# Altium schematic sheet [02] - CONNECTORS.SchDoc: CONNECTORS
size 433 x 279 mm; Author: ZAG; DrawnBy: ZAG; DocumentNumber: 2; SheetNumber: 2; SheetTotal: 8; PageSetup: Record=PageOptions|CenterHorizontal=True|CenterVertical=True|PrintScale=0.96|XCorrection=1.00|YCorrection=1.00|PrintKind=2|BorderSize=5000000|LeftOffset=0|BottomOffset=0|Orientation=2|PaperLength=4318|PaperWidth=2794|Scale=100|PaperSource=15|PrintQuality=600|MediaType=1|DitherType=10|PaperKind=11x17|PrintScaleMode=1; SchRevision: 01; PCBRevision: 01; Project: VAN BATT CTRLR V1; SchStatus: PRELIM
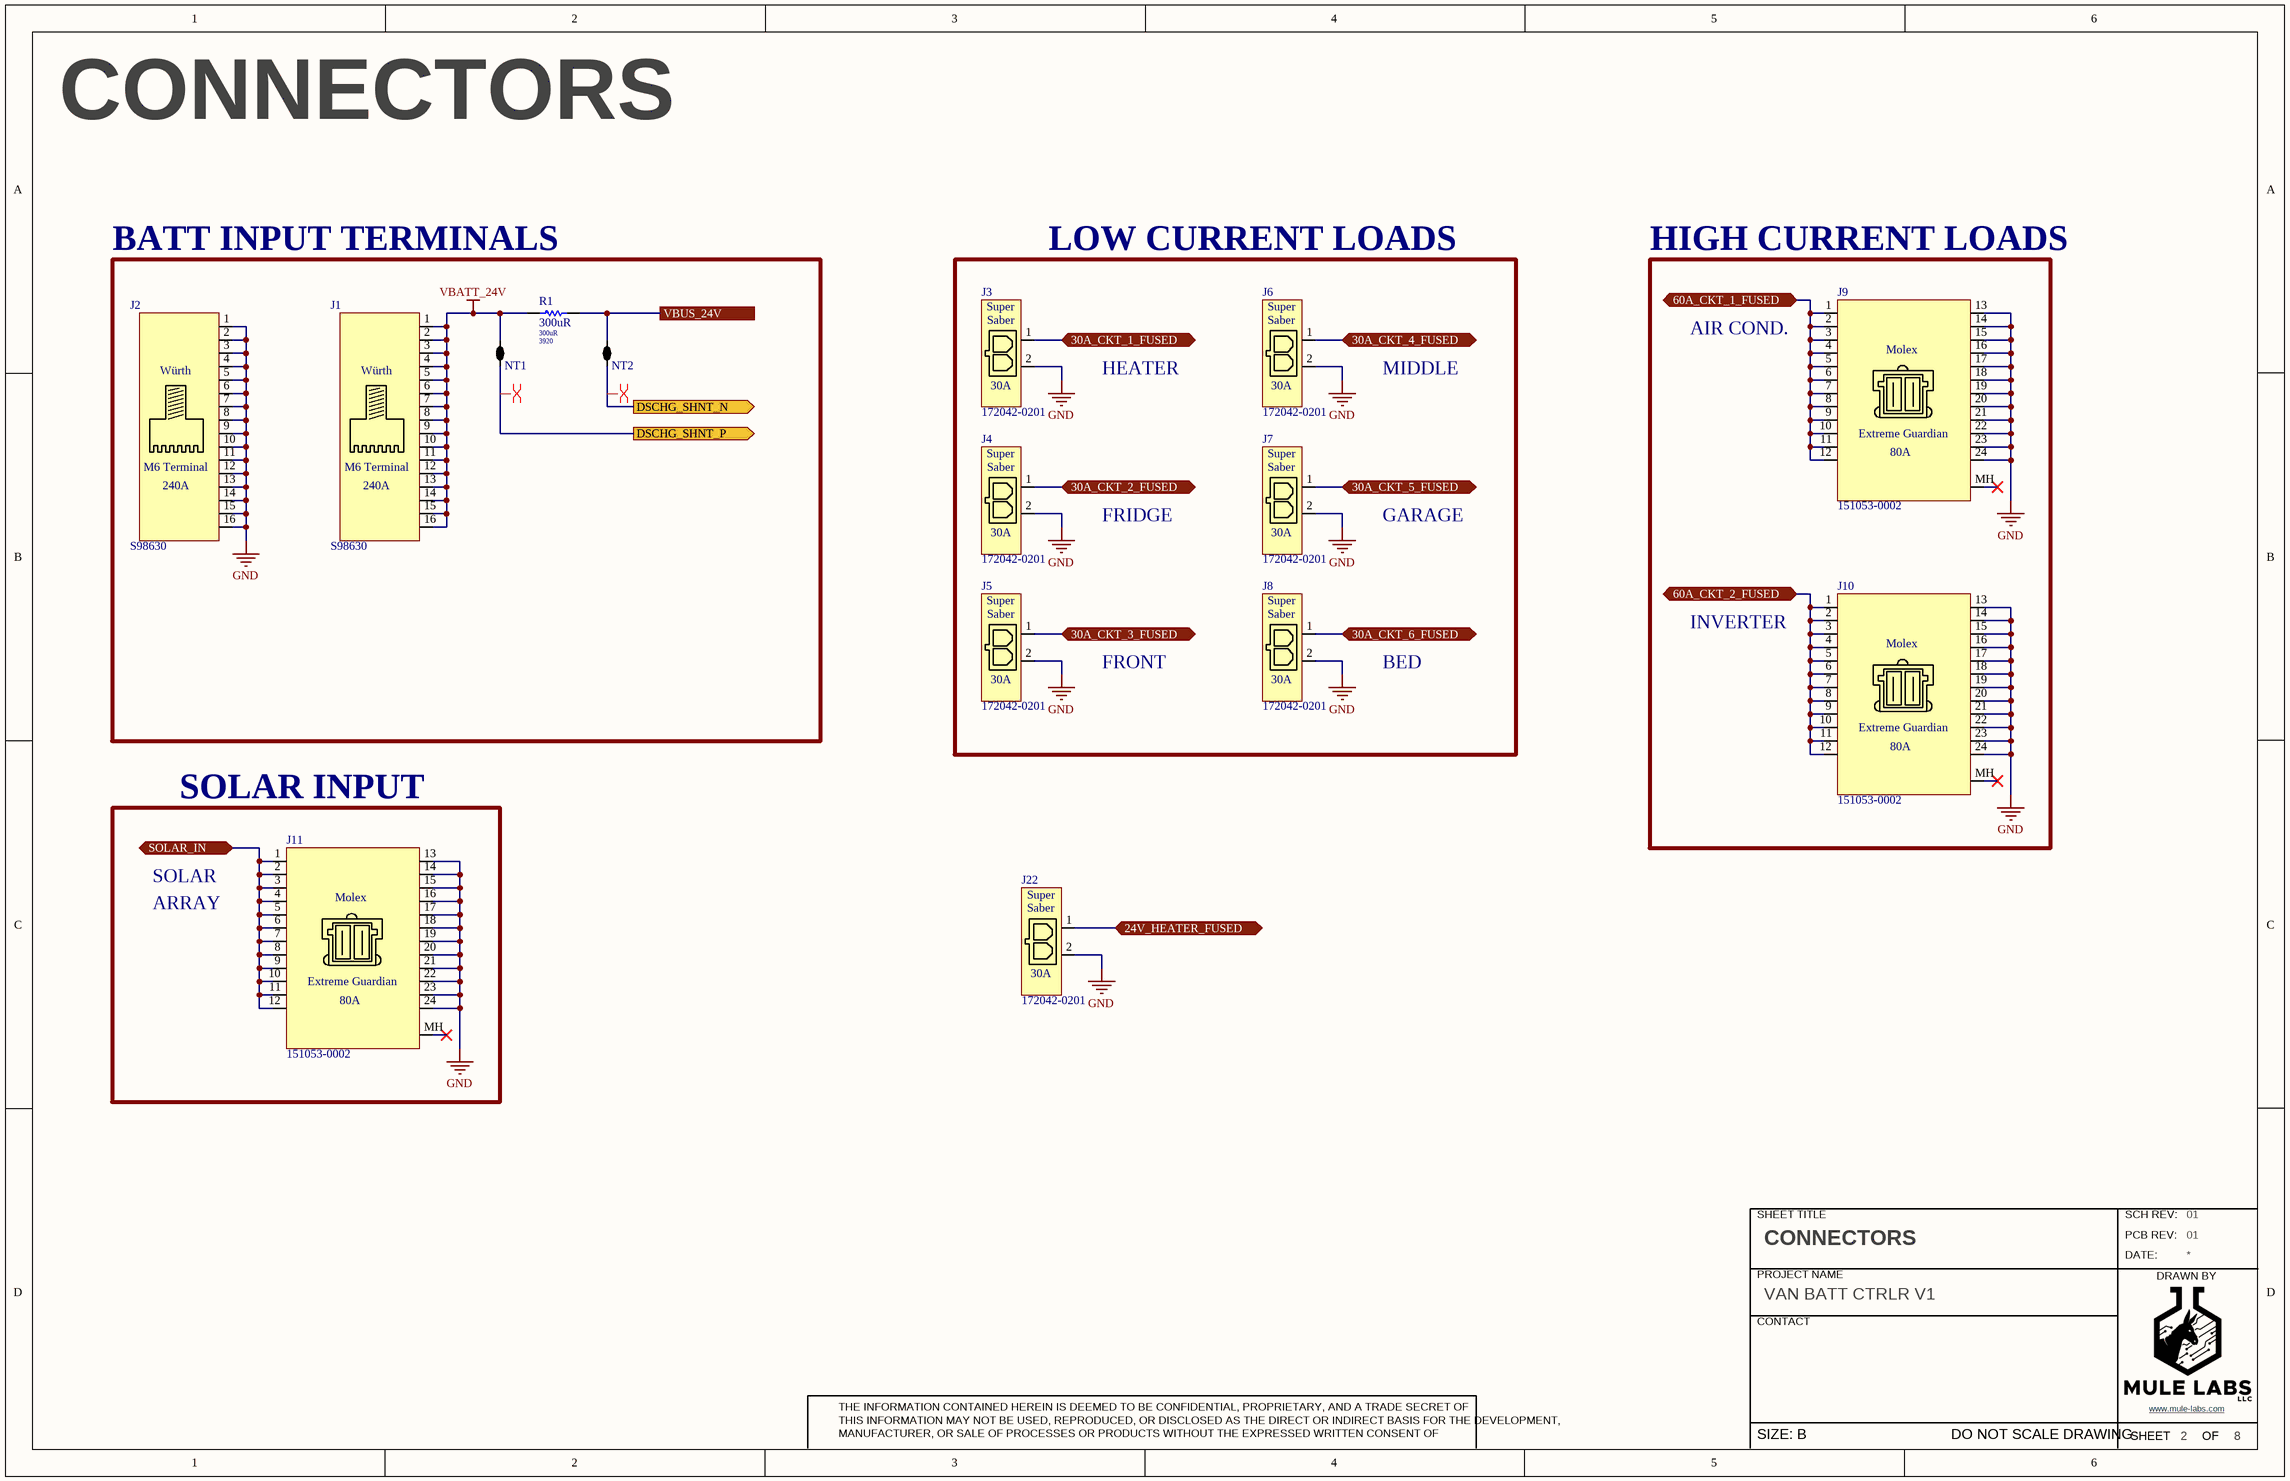
[diagram p0: [02] - CONNECTORS.SchDoc]

## Parts
J1  S98630  [WURTH_S98630]
J2  S98630  [WURTH_S98630]
J3  172042-0201  [MOLEX_1720420201]
J4  172042-0201  [MOLEX_1720420201]
J5  172042-0201  [MOLEX_1720420201]
J6  172042-0201  [MOLEX_1720420201]
J7  172042-0201  [MOLEX_1720420201]
J8  172042-0201  [MOLEX_1720420201]
J9  151053-0002  [MOLEX_151053-0002]
J10  151053-0002  [MOLEX_151053-0002]
J11  151053-0002  [MOLEX_151053-0002]
J22  172042-0201  [MOLEX_1720420201]
NT1  2 way net tie junction  [2way_LP]  (value not drawn)  (net tie, no BOM)
NT2  2 way net tie junction  [2way_LP]  (value not drawn)  (net tie, no BOM)
R1  300uR  Package: 3920  [VISHAY_3920]

## Blocks framed on the sheet
BATT INPUT TERMINALS: J1 J2 NT1 NT2 R1
LOW CURRENT LOADS: J3-J8
HIGH CURRENT LOADS: J9 J10
SOLAR INPUT: J11

## Ports
24V_HEATER_FUSED (bidir), 30A_CKT_1_FUSED (bidir), 30A_CKT_2_FUSED (bidir), 30A_CKT_3_FUSED (bidir), 30A_CKT_4_FUSED (bidir), 30A_CKT_5_FUSED (bidir), 30A_CKT_6_FUSED (bidir), 60A_CKT_1_FUSED (bidir), 60A_CKT_2_FUSED (bidir), DSCHG_SHNT_N (out), DSCHG_SHNT_P (out), SOLAR_IN (bidir), VBUS_24V

## Nets
GND: J2.1 J2.2 J2.3 J2.4 J2.5 J2.6 J2.7 J2.8 J2.9 J2.10 J2.11 J2.12 J2.13 J2.14 J2.15 J2.16 J3.2 J4.2 J5.2 J6.2 J7.2 J8.2 J9.13 J9.14 J9.15 J9.16 J9.17 J9.18 J9.19 J9.20 J9.21 J9.22 J9.23 J9.24 J10.13 J10.14 J10.15 J10.16 J10.17 J10.18 J10.19 J10.20 J10.21 J10.22 J10.23 J10.24 J11.13 J11.14 J11.15 J11.16 J11.17 J11.18 J11.19 J11.20 J11.21 J11.22 J11.23 J11.24 J22.2
VBATT_24V: J1.1 J1.2 J1.3 J1.4 J1.5 J1.6 J1.7 J1.8 J1.9 J1.10 J1.11 J1.12 J1.13 J1.14 J1.15 J1.16 NT1.2 R1.2
24V_HEATER_FUSED: J22.1 ; port 24V_HEATER_FUSED
30A_CKT_1_FUSED: J3.1 ; port 30A_CKT_1_FUSED
30A_CKT_2_FUSED: J4.1 ; port 30A_CKT_2_FUSED
30A_CKT_3_FUSED: J5.1 ; port 30A_CKT_3_FUSED
30A_CKT_4_FUSED: J6.1 ; port 30A_CKT_4_FUSED
30A_CKT_5_FUSED: J7.1 ; port 30A_CKT_5_FUSED
30A_CKT_6_FUSED: J8.1 ; port 30A_CKT_6_FUSED
60A_CKT_1_FUSED: J9.1 J9.2 J9.3 J9.4 J9.5 J9.6 J9.7 J9.8 J9.9 J9.10 J9.11 J9.12 ; port 60A_CKT_1_FUSED
60A_CKT_2_FUSED: J10.1 J10.2 J10.3 J10.4 J10.5 J10.6 J10.7 J10.8 J10.9 J10.10 J10.11 J10.12 ; port 60A_CKT_2_FUSED
DSCHG_SHNT_N: NT2.1 ; port DSCHG_SHNT_N
DSCHG_SHNT_P: NT1.1 ; port DSCHG_SHNT_P
SOLAR_IN: J11.1 J11.2 J11.3 J11.4 J11.5 J11.6 J11.7 J11.8 J11.9 J11.10 J11.11 J11.12 ; port SOLAR_IN
VBUS_24V: NT2.2 R1.1 ; port VBUS_24V

Not connected (* = marked no-connect by the designer): J9 MH(22)*; J10 MH(22)*; J11 MH(22)*

## Layout directives
differential pair: DSCHG_SHNT_N, DSCHG_SHNT_P

## Notes on the sheet
- AIR COND.
- HEATER
- MIDDLE
- FRIDGE
- GARAGE
- INVERTER
- FRONT
- BED
- SOLAR
- ARRAY
- SHEET TITLE
- SCH REV:
- PROJECT NAME
- PCB REV:
- DATE:
- DRAWN BY
- CONTACT
- MANUFACTURER, OR SALE OF PROCESSES OR PRODUCTS WITHOUT THE EXPRESSED WRITTEN CONSENT OF
- THE INFORMATION CONTAINED HEREIN IS DEEMED TO BE CONFIDENTIAL, PROPRIETARY, AND A TRADE SECRET OF
- THIS INFORMATION MAY NOT BE USED, REPRODUCED, OR DISCLOSED AS THE DIRECT OR INDIRECT BASIS FOR THE DEVELOPMENT,
- SHEET
- www.mule-labs.com <http://www.mule-labs.com>
- OF
- SIZE: B
- DO NOT SCALE DRAWING
- (in symbol 151053-0002) Extreme Guardian
- (in symbol 172042-0201) Super; Saber
- (in symbol S98630) Würth; M6 Terminal; 240A

## Library data of the parts
J1 J2 = S98630: Manufacturer: Wurth Electronics; Supplier 1: Digi-Key; Manufacturer Part Number: S98630; RoHS: No; Category: Terminals; Stock 1: 141; Pricing 1: 1=4.00000, 10=3.50000, 50=3.00000, 100=2.50000, 500=2.05000 (USD); ComponentLink1URL: https://media.digikey.com/pdf/Data%20Sheets/Wurth%20Electronics%20PDFs/S98630_Drawing.pdf?src-supplier=Digi-Key; ComponentLink1Description: https://media.digikey.com/pdf/Data%20Sheets/Wurth%20Electronics%20PDFs/S98630_Drawing.pdf?src-supplier=Digi-Key; Supplier Part Number 1: 2101-S98630-ND
J3-J8 J22 = 172042-0201: Conn Power HDR 2 POS 7.49mm Solder ST Thru-Hole 2 Terminal 1 Port Super Sabre™ Frame; Manufacturer: Molex; Number of Positions: 2; Voltage Rating: 600V; Current Rating: 30A; Pitch: 0.295inch; Supplier 1: Digi-Key; Manufacturer Part Number: 172042-0201; RoHS: Yes; Category: Headers and Wire Housings; Stock 1: 5706; Pricing 1: 1=1.81000, 10=1.54100, 80=1.27263, 1050=1.00470, 5250=0.89083, 10500=0.87073 (USD); Mount: Through Hole; Number of Pins: 2; Color: Black; Contact Material: Copper; Contact Plating: Silver; Insulation Material: Polymer; Min Operating Temperature: -40°C; Max Operating Temperature: 125°C; Packaging: Tray; Number of Rows: 1; Termination: Solder; Fastening Type: Ramp; Number of Circuits: 2; Orientation: Vertical; ComponentLink1URL: https://www.mouser.com/ds/2/276/1720420201_PCB_HEADERS-704088.pdf?src-supplier=Mouser; ComponentLink1Description: https://www.mouser.com/ds/2/276/1720420201_PCB_HEADERS-704088.pdf?src-supplier=Mouser; ComponentLink2URL: http://www.molex.com/pdm_docs/sd/1720420201_sd.pdf?src-supplier=Digi-Key; ComponentLink2Description: http://www.molex.com/pdm_docs/sd/1720420201_sd.pdf?src-supplier=Digi-Key; Supplier Part Number 1: WM16204-ND
J9-J11 = 151053-0002: 11.00mm Pitch EXTreme Guardian Power Vertical Plug PCB Header, 2.30mm PCB Thickness, Gold (Au) Plating, 2 Circuits; Manufacturer: Molex; Number of Positions: 2; Voltage Rating: 600V; Current Rating: 80A; Gender: Male; Pitch: 0.433inch; Supplier 1: Digi-Key; Manufacturer Part Number: 151053-0002; RoHS: Yes; Category: Headers and Wire Housings; Mount: Through Hole; Number of Pins: 2; Color: Black; Contact Material: Copper Alloy; Contact Plating: Gold; Insulation Material: Polymer; Min Operating Temperature: -40°C; Max Operating Temperature: 105°C; Packaging: Tray; Connector Type: Plug; Number of Rows: 1; Termination: Solder; Fastening Type: Ramp; REACH SVHC: Unknown; ComponentLink1URL: http://www.farnell.com/datasheets/2067232.pdf?src-supplier=Element14; ComponentLink1Description: http://www.farnell.com/datasheets/2067232.pdf?src-supplier=Element14; ComponentLink2URL: http://www.molex.com/pdm_docs/ps/PS-151053-0000.pdf?src-supplier=Digi-Key; ComponentLink2Description: http://www.molex.com/pdm_docs/ps/PS-151053-0000.pdf?src-supplier=Digi-Key; Supplier Part Number 1: WM14985-ND
NT1 NT2 = 2way: ComponentLink1URL: http://www.edatools.cz/addons; ComponentLink1Description: Source; FootprintNote: LP=12mil, MP=40mil, HP=120mil
R1 = Y14840R00030F9R: CSM3920A 0R0030 1.0% S T 130800 Chip Resistor Strip 3920 (1052 Metric); Manufacturer: Vishay Precision Group; Supplier 1: Digi-Key; Manufacturer Part Number: Y14840R00030F9R; RoHS: No; Category: Chip SMD Resistors; Stock 1: 5999; Pricing 1: 1=1.970000, 10=1.750000, 25=1.622400, 50=1.527200, 100=1.336200, 250=1.145360, 500=0.954440, 1000=0.827190 (USD); Supplier Part Number 1: 804-Y14840R00030F9RCT-ND; Resistance: 300uR